# Altium schematic sheet WL_PGA_ATT.SchDoc
size 420 x 297 mm; SheetNumber: 4; SheetTotal: 9
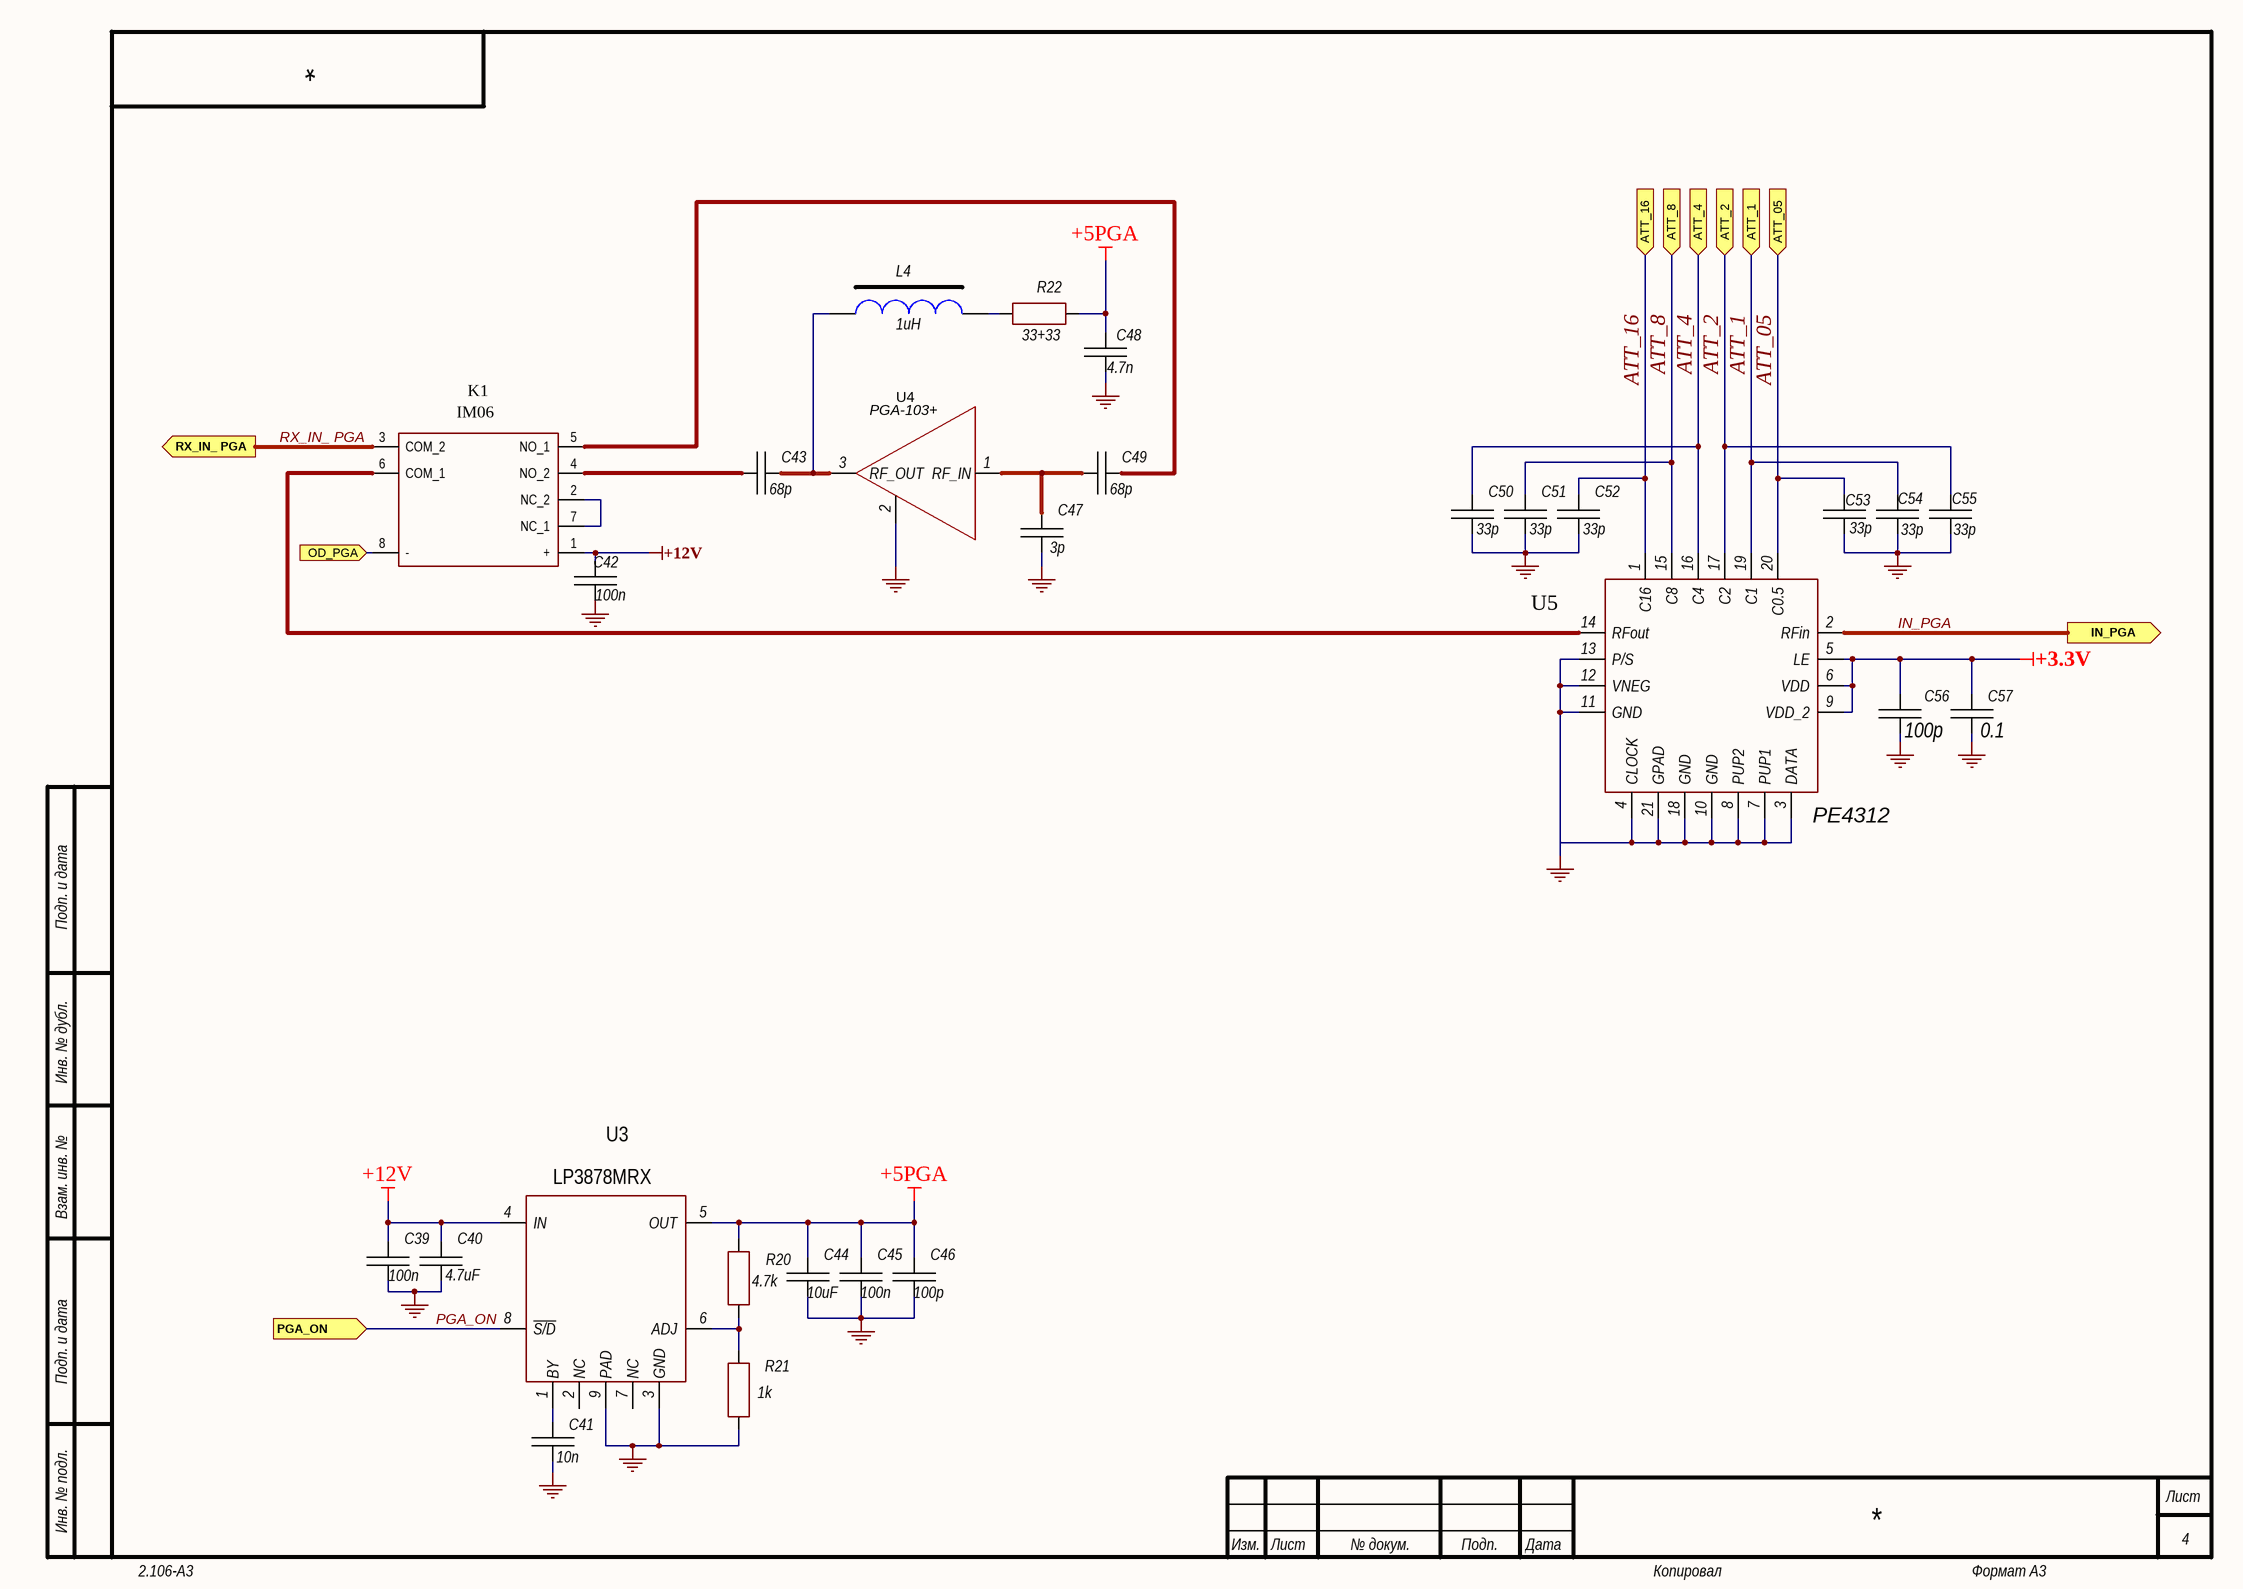
[diagram p0: WL_PGA_ATT.SchDoc]

## Parts
C39  100n  [CH0805C]
C40  4.7uF  [CH0805C]
C41  10n  [CH0805C]
C42  100n  [CH0805C]
C43  68p  [CH0805C]
C44  10uF  [CH0805C]
C45  100n  [CH0805C]
C46  100p  [CH0805C]
C47  3p  [CH0805C]
C48  4.7n  [CH0805C]
C49  68p  [CH0805C]
C50  33p  [CH0603C]
C51  33p  [CH0603C]
C52  33p  [CH0603C]
C53  33p  [CH0603C]
C54  33p  [CH0603C]
C55  33p  [CH0603C]
C56  100p  [CH0805C]
C57  0.1  [CH0805C]
K1  IM06  [IM06]
L4  1uH  [L1210]
R20  4.7k  [CH0805R]
R21  1k  [CH0805R]
R22  33+33  [CH1206R]
U3  LP3878MRX  [8-SOIC (PAD)]
U4  PGA-103+  [SOT89_123]
U5  PE4312  [20-QFN (4x4)]

## Ports
ATT_1 (in), ATT_2 (in), ATT_4 (in), ATT_05 (in), ATT_8 (in), ATT_16 (in), IN_PGA (out), OD_PGA (in), PGA_ON (in), RX_IN_ PGA (out)

## Nets
+3.3V: C56.1 C57.1 U5.5(LE) U5.6(VDD) U5.9(VDD_2)
+5PGA: C44.2 C45.2 C46.2 C48.2 R20.2 R22.2 U3.5(OUT)
+12V: C39.2 C40.2 C42.2 K1.1(+) U3.4(IN)
GND: C39.1 C40.1 C41.1 C42.1 C44.1 C45.1 C46.1 C47.1 C48.1 C50.1 C51.1 C52.1 C53.1 C54.1 C55.1 C56.2 C57.2 R21.1 U3.3(GND) U3.9(PAD) U4.2(GND) U5.3(DATA) U5.4(CLOCK) U5.7(PUP1) U5.8(PUP2) U5.10(GND) U5.11(GND) U5.12(VNEG) U5.13(P/S) U5.18(GND) U5.21(GPAD)
ATT_1: C54.2 U5.19(C1) ; port ATT_1
ATT_2: C55.2 U5.17(C2) ; port ATT_2
ATT_4: C50.2 U5.16(C4) ; port ATT_4
ATT_05: C53.2 U5.20(C0.5) ; port ATT_05
ATT_8: C51.2 U5.15(C8) ; port ATT_8
ATT_16: C52.2 U5.1(C16) ; port ATT_16
IN_PGA: U5.2(RFin) ; port IN_PGA
OD_PGA: K1.8(-) ; port OD_PGA
PGA_ON: U3.8(~{S/D}) ; port PGA_ON
RX_IN_ PGA: K1.3(COM_2) ; port RX_IN_ PGA
NetC41_2: C41.2 U3.1(BY)
NetC43_1: C43.1 K1.4(NO_2)
NetC43_2: C43.2 L4.2 U4.3(RF_OUT)
NetC47_2: C47.2 C49.1 U4.1(RF_IN)
NetC49_2: C49.2 K1.5(NO_1)
NetK1_2: K1.2(NC_2) K1.7(NC_1)
NetK1_6: K1.6(COM_1) U5.14(RFout)
NetL4_1: L4.1 R22.1
NetR20_1: R20.1 R21.2 U3.6(ADJ)

Not connected (* = marked no-connect by the designer): U3 2(NC) 7(NC)

## Notes on the sheet
- Подп. и дата
- Инв. № дубл.
- Взам. инв. №
- Инв. № подл.
- Изм.
- Лист
- № докум.
- Подп.
- Дата
- 2.106-A3
- Копировал
- Формат А3

## Library data of the parts
C39-C57 = Capacitor: Manufacturer: *; Model: *; HelpURL: *; ComponentKind: *; Value: *
K1 = IM06-V1
L4 = TRANS
R20-R22 = Resistor: Manufacturer: *; Model: *; HelpURL: *; ComponentKind: *; Value: *
U3 = LP3878
U5 = PE4302